# EAGLE design programming adapter board (EAGLE 9.4.0)
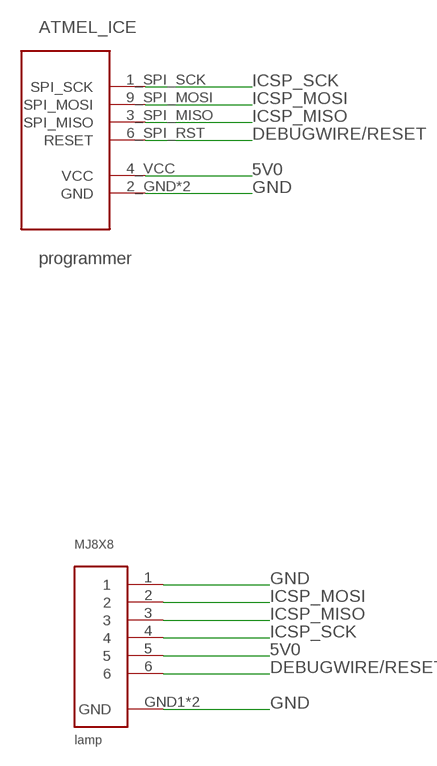
[diagram p0: schematic, sheet 1]

## Parts
ATMEL_ICE  programmer  SPI-1.27-10-PIN-HEADER  [SMT-JTAG]
MJ8X8  lamp  5034800600  [SMT]

## Nets
5V0: ATMEL_ICE.4_VCC(VCC) MJ8X8.5
DEBUGWIRE/RESET: ATMEL_ICE.6_SPI_RST(RESET) MJ8X8.6
GND: ATMEL_ICE.2_GND(GND) ATMEL_ICE.10_GND(GND) MJ8X8.1 MJ8X8.GND1(GND) MJ8X8.GND2(GND)
ICSP_MISO: ATMEL_ICE.3_SPI_MISO(SPI_MISO) MJ8X8.3
ICSP_MOSI: ATMEL_ICE.9_SPI_MOSI(SPI_MOSI) MJ8X8.2
ICSP_SCK: ATMEL_ICE.1_SPI_SCK(SPI_SCK) MJ8X8.4

## Library data of the parts
ATMEL_ICE = SPI 1.27mm 10pin header:SPI-1.27-10-PIN-HEADER
MJ8X8 = 5034800600 FPC Connector:5034800600

## Board
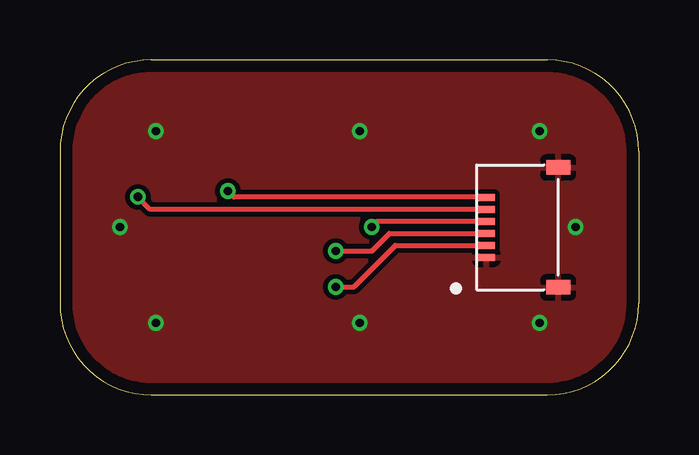
[diagram p1: board, top side]
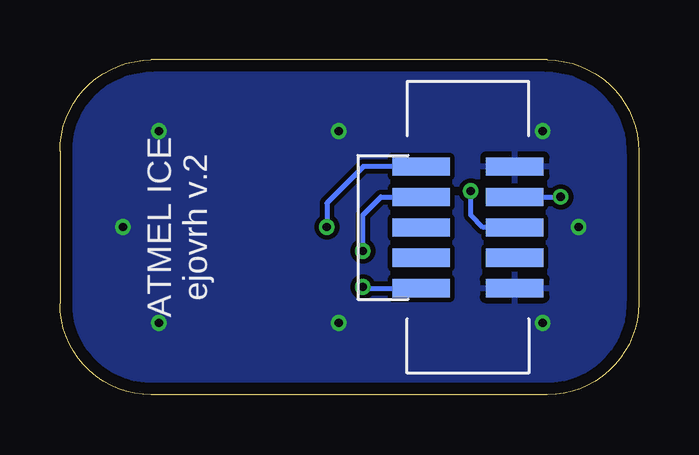
[diagram p2: board, bottom side, seen from below]

Size 24.13 x 13.97 mm. Coordinates in mm from the lower left corner, seen from the top.
Outline: 0,10.16 0,3.81 arc90 3.81,0 20.32,0 arc90 24.13,3.81 24.13,10.16 arc90 20.32,13.97 3.81,13.97 arc90 0,10.16
Copper layers (1*16): Top 0.035mm / dielectric 1.5mm / Bottom 0.035mm
Design rules "markovac_2layer": minimum track width 0.2mm, minimum drill 0.35mm, track to track 0.2mm, track to pad 0.2mm, pad to pad 0.2mm, via to via 0.2mm, smd to smd 0.2mm, copper to edge 0.5mm, drill to drill 8mil, minimum pad ring 0.15mm, minimum via ring 0.15mm, stop-mask expansion 4mil, vias tented up to drill 0.34mm, thermal gap 10mil

### Footprints (pad centres in the part's own frame; a part is rotated, then mirrored left to right if it is on the bottom)
SMT-JTAG = smd 0.76 x 2.4: 1_SPI_SCK -2.54,-1.94; 2_GND -2.54,1.955; 3_SPI_MISO -1.27,-1.95; 4_VCC -1.27,1.95; 5_NC 0,-1.95; 6_SPI_RST 0,1.95; 7_NC 1.27,-1.95; 8_NC 1.27,1.95; 9_SPI_MOSI 2.54,-1.95; 10_GND 2.54,1.95
SMT = smd 0.3 x 0.7: 1 -1.25,1.27; 2 -0.75,1.27; 3 -0.25,1.27; 4 0.25,1.27; 5 0.75,1.27; 6 1.25,1.27 | smd 0.6 x 1: GND1 -2.5,-1.73; GND2 2.5,-1.73

### Placement (x,y rotation side)
ATMEL_ICE  7.12,6.99 270 bottom
MJ8X8  19.05,6.99 90 top

### Tracks (layer width: path | path; a pad name or v marks a point on that pad's centre or on a via)
5V0  (via drill 0.35)
  Top 0.2: MJ8X8.5 3.77,7.74 v3.25,8.26
  Bottom 0.2: ATMEL_ICE.4_VCC v3.25,8.26
DEBUGWIRE/RESET  (via drill 0.35)
  Top 0.2: v7,8.5 7.25,8.25 17.77,8.25 MJ8X8.6
  Bottom 0.2: ATMEL_ICE.6_SPI_RST 6.49,6.99 7,7.5 v7,8.5
GND  (via drill 0.35)
  other vias: 4,11 4,3 20,3 20,11 2.5,7 21.5,7 12.5,11 12.5,3
  pour Top: 0,0 0,14 23.5,13.97 23.5,0
  pour Bottom: 0,0 0,14 23.5,13.97 23.5,0
ICSP_MISO  (via drill 0.35)
  Top 0.2: MJ8X8.3 13.73,6.74 13,6 v11.5,6
  Bottom 0.2: v11.5,6 11.5,7.5 10.74,8.26 ATMEL_ICE.3_SPI_MISO
ICSP_MOSI  (via drill 0.35)
  Top 0.2: MJ8X8.2 13.98,6.24 12.25,4.5 v11.5,4.5
  Bottom 0.2: v11.5,4.5 11.45,4.45 ATMEL_ICE.9_SPI_MOSI
ICSP_SCK  (via drill 0.35)
  Top 0.2: MJ8X8.4 13.23,7.24 v13,7
  Bottom 0.2: ATMEL_ICE.1_SPI_SCK 11.47,9.53 13,8 v13,7

### Text on the board
bPlace: ejovrh v.2 | ATMEL ICE